# Altium schematic sheet Main.SchDoc
size A3
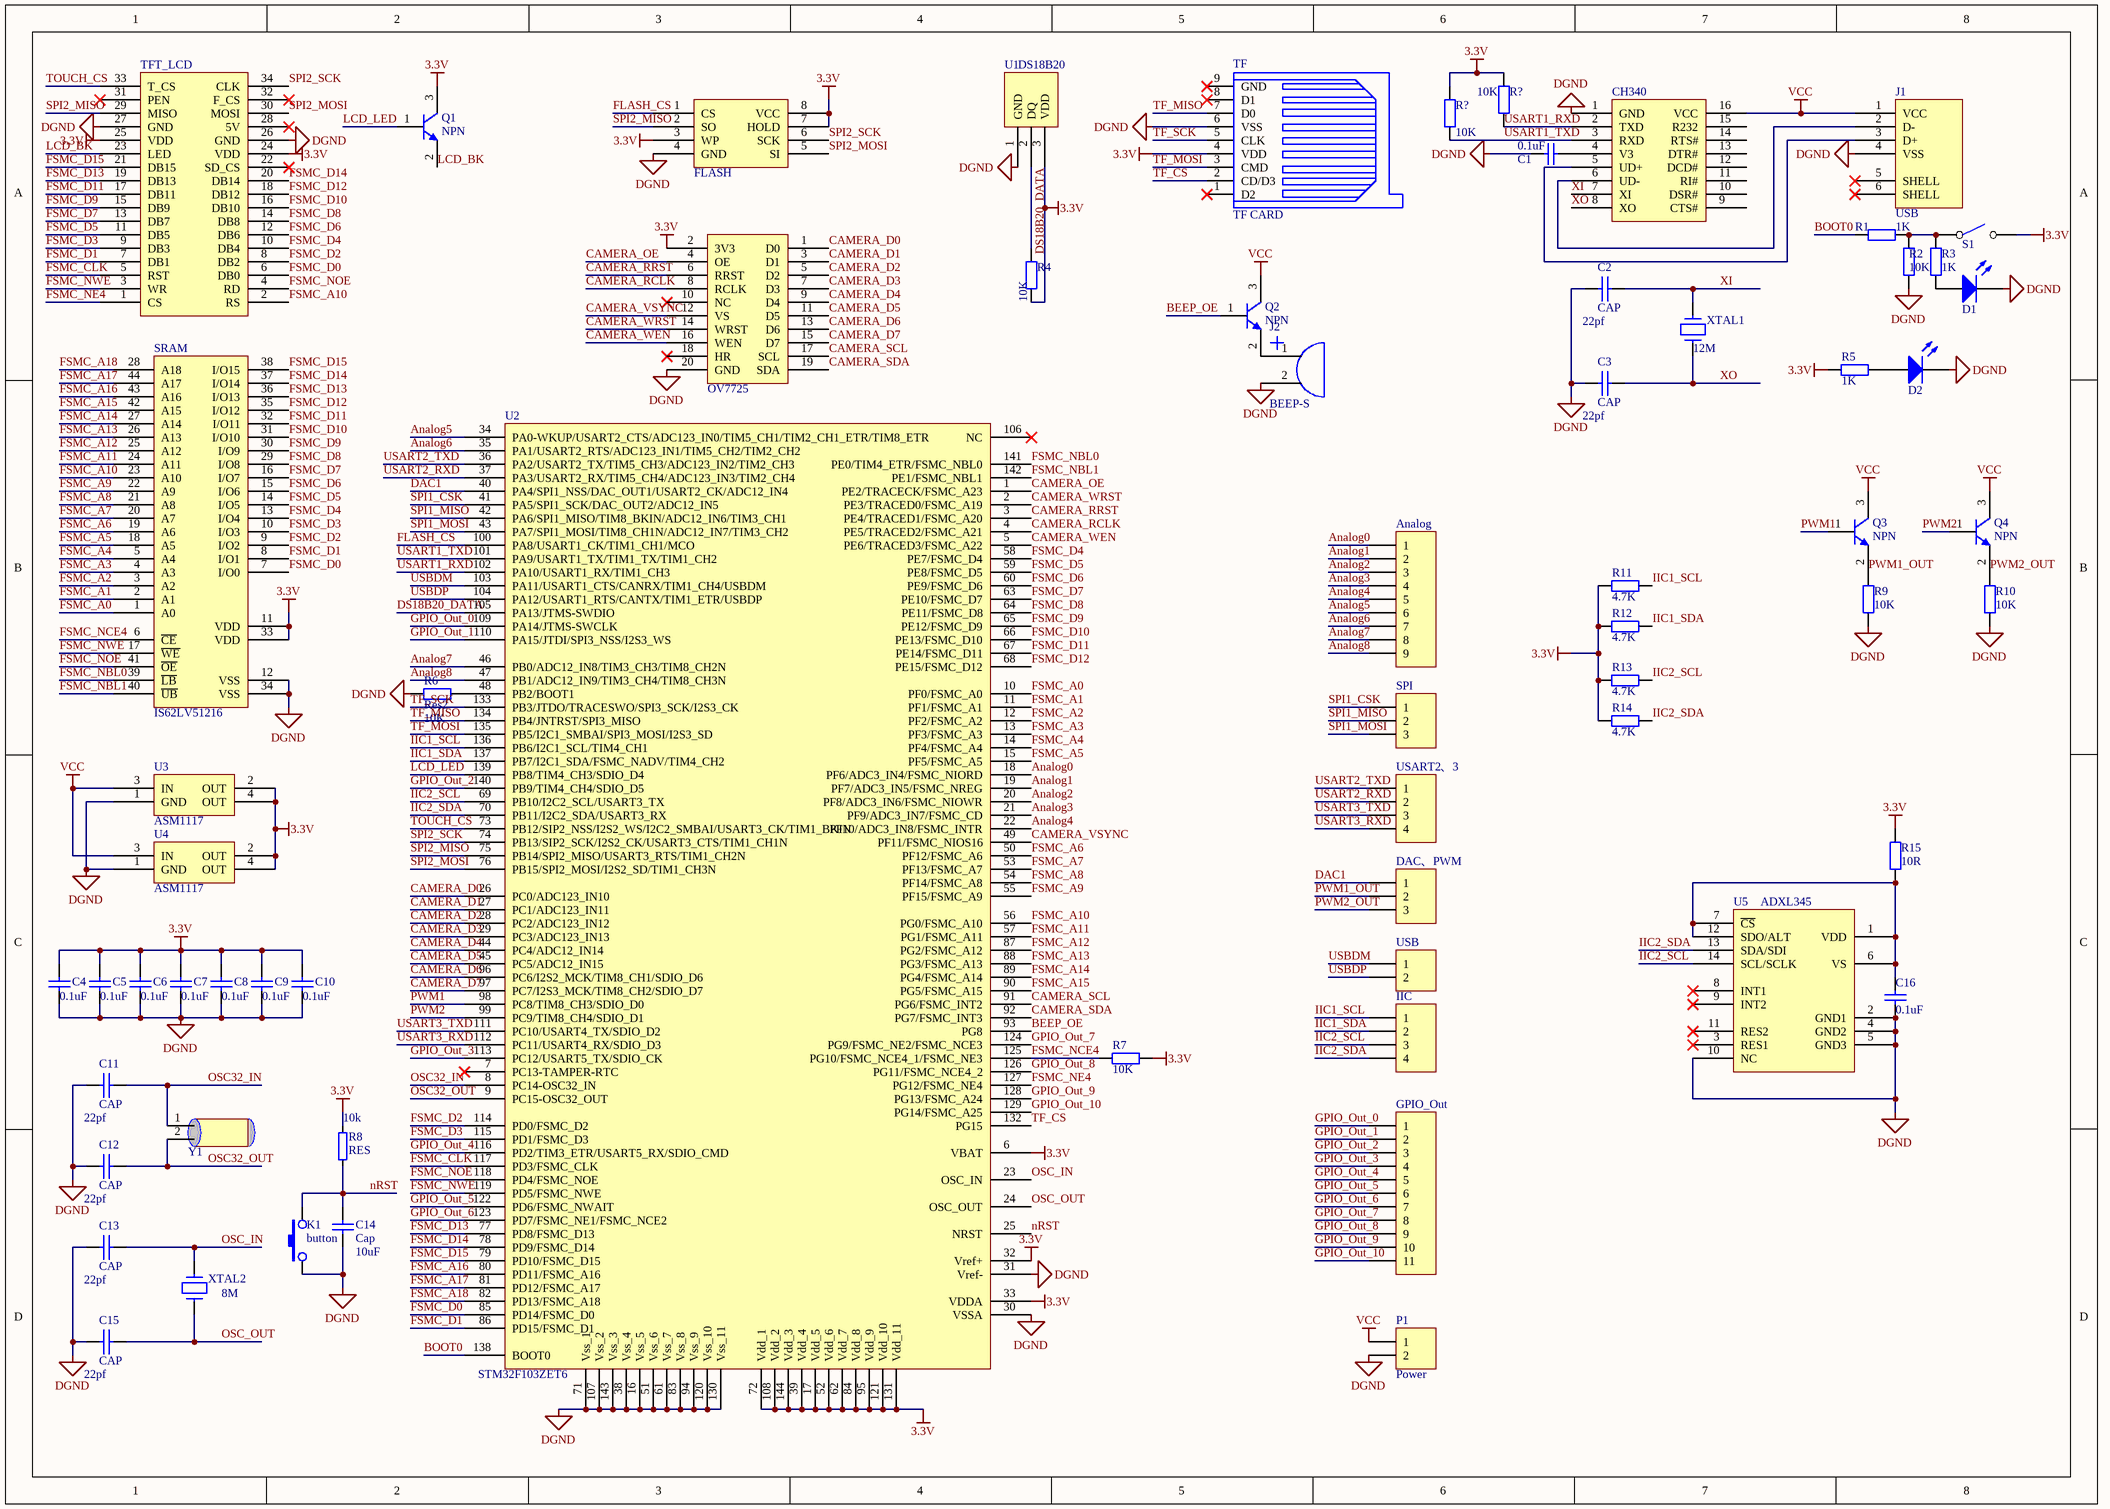
[diagram p0: Main.SchDoc]

## Parts
(Parts that share a designator on the sheet are numbered #1, #2 ... from top to bottom, then left to right.)
Analog  Header 9  [HDR1X9]  (value not drawn)
C1  value 0.1uF  [0805]  (hidden comment: Cap)
C2  CAP  value 22pf  [0805]
C3  CAP  value 22pf  [0805]
C4  value 0.1uF  [0805]  (hidden comment: Cap)
C5  value 0.1uF  [0805]  (hidden comment: Cap)
C6  value 0.1uF  [0805]  (hidden comment: Cap)
C7  value 0.1uF  [0805]  (hidden comment: Cap)
C8  value 0.1uF  [0805]  (hidden comment: Cap)
C9  value 0.1uF  [0805]  (hidden comment: Cap)
C10  value 0.1uF  [0805]  (hidden comment: Cap)
C11  CAP  value 22pf  [0805]
C12  CAP  value 22pf  [0805]
C13  CAP  value 22pf  [0805]
C14  Cap  value 10uF  [1206]
C15  CAP  value 22pf  [0805]
C16  value 0.1uF  [0805]  (hidden comment: Cap)
CH340  Component_1  [SOIC127P600X170-16N]  (value not drawn)
D1  LED0  [LED-0805]  (value not drawn)
D2  LED0  [LED-0805]  (value not drawn)
DAC、PWM  Header 3  [HDR1X3]  (value not drawn)
FLASH  W25Q64  [8S2_L]  (value not drawn)
GPIO_Out  Header 11  [HDR1X11]  (value not drawn)
IIC  Header 4  [HDR1X4]  (value not drawn)
J1  USB  [USB_A1]
J2  BEEP-S  [BEEP-S]
K1  button  [SW_PB4_A1]
OV7725  OV7725摄像头  [HDR2X10]  (value not drawn)
P1  Power  [HDR1X2]
Q1  NPN  [SOT23-3]
Q2  NPN  [SOT23-3]
Q3  NPN  [SOT23-3]
Q4  NPN  [SOT23-3]
R1  value 1K  [0805]  (hidden comment: Res2)
R2  value 10K  [0805]  (hidden comment: Res2)
R3  value 1K  [0805]  (hidden comment: Res2)
R4  value 10K  [0805]  (hidden comment: Res2)
R5  value 1K  [0805]  (hidden comment: Res2)
R6  Res2  value 10K  [0805]
R7  value 10K  [0805]  (hidden comment: Res2)
R8  RES  value 10k  [0805]
R9  value 10K  [0805]  (hidden comment: Res2)
R10  value 10K  [0805]  (hidden comment: Res2)
R11  value 4.7K  [0805]  (hidden comment: Res2)
R12  value 4.7K  [0805]  (hidden comment: Res2)
R13  value 4.7K  [0805]  (hidden comment: Res2)
R14  value 4.7K  [0805]  (hidden comment: Res2)
R15  value 10R  [0805]  (hidden comment: Res2)
R?#1  value 10K  [AXIAL-0.4]  (hidden comment: Res2)
R?#2  value 10K  [AXIAL-0.4]  (hidden comment: Res2)
S1  单刀开关  [SWITCH_B1]  (value not drawn)
SPI  Header 3  [HDR1X3]  (value not drawn)
SRAM  IS62LV51216  [TSOP-44]
TF  TF CARD  [TFP09-2-12B]
TFT_LCD  Component_1  [HDR2X17]  (value not drawn)
U1  DS18B20  [TO-92A]
U2  STM32F103ZET6  [TQFP-144]
U3  ASM1117  [SOT223]
U4  ASM1117  [SOT223]
U5  ADXL345  [PCBComponent_1]
USART2、3  Header 4  [HDR1X4]  (value not drawn)
USB  Header 2  [HDR1X2]  (value not drawn)
XTAL1  value 12M  [X-SM49]  (hidden comment: CRYSTAL)
XTAL2  value 8M  [X-SM49]  (hidden comment: CRYSTAL)
Y1  32K晶振  [X-TC15]  (value not drawn)

## Nets
3.3V: C4.2 C5.2 C6.2 C7.2 C8.2 C9.2 C10.2 FLASH.3(WP) FLASH.7(HOLD) FLASH.8(VCC) OV7725.2(3V3) Q1.3(C) R4.1 R5.1 R7.2 R8.2 R11.1 R12.1 R13.1 R14.1 R15.2 R?#1.2 R?#2.2 S1.2 SRAM.11(VDD) SRAM.33(VDD) TF.4(VDD) TFT_LCD.24(VDD) TFT_LCD.25(VDD) U1.3(VDD) U2.6(VBAT) U2.17(Vdd_5) U2.32(Vref+) U2.33(VDDA) U2.39(Vdd_4) U2.52(Vdd_6) U2.62(Vdd_7) U2.72(Vdd_1) U2.84(Vdd_8) U2.95(Vdd_9) U2.108(Vdd_2) U2.121(Vdd_10) U2.131(Vdd_11) U2.144(Vdd_3) U3.2(OUT) U3.4(OUT) U4.2(OUT) U4.4(OUT)
DGND: C1.2 C2.1 C3.1 C4.1 C5.1 C6.1 C7.1 C8.1 C9.1 C10.1 C11.1 C12.1 C13.1 C14.1 C15.1 C16.1 CH340.1(GND) D1.2(K) D2.2(K) FLASH.4(GND) J1.4(VSS) J2.2 K1.1 OV7725.20(GND) P1.2 R2.1 R6.1 R9.1 R10.1 SRAM.12(VSS) SRAM.34(VSS) TF.6(VSS) TFT_LCD.26(GND) TFT_LCD.27(GND) U1.1(GND) U2.16(Vss_5) U2.30(VSSA) U2.31(Vref-) U2.38(Vss_4) U2.51(Vss_6) U2.61(Vss_7) U2.71(Vss_1) U2.83(Vss_8) U2.94(Vss_9) U2.107(Vss_2) U2.120(Vss_10) U2.130(Vss_11) U2.143(Vss_3) U3.1(GND) U4.1(GND) U5.2(GND1) U5.4(GND2) U5.5(GND3) U5.10(NC)
VCC: CH340.16(VCC) J1.1(VCC) P1.1 Q2.3(C) Q3.3(C) Q4.3(C) U3.3(IN) U4.3(IN)
Analog0: Analog.1 U2.18(PF6/ADC3_IN4/FSMC_NIORD)
Analog1: Analog.2 U2.19(PF7/ADC3_IN5/FSMC_NREG)
Analog2: Analog.3 U2.20(PF8/ADC3_IN6/FSMC_NIOWR)
Analog3: Analog.4 U2.21(PF9/ADC3_IN7/FSMC_CD)
Analog4: Analog.5 U2.22(PF10/ADC3_IN8/FSMC_INTR)
Analog5: Analog.6 U2.34(PA0-WKUP/USART2_CTS/ADC123_IN0/TIM5_CH1/TIM2_CH1_ETR/TIM8_ETR)
Analog6: Analog.7 U2.35(PA1/USART2_RTS/ADC123_IN1/TIM5_CH2/TIM2_CH2)
Analog7: Analog.8 U2.46(PB0/ADC12_IN8/TIM3_CH3/TIM8_CH2N)
Analog8: Analog.9 U2.47(PB1/ADC12_IN9/TIM3_CH4/TIM8_CH3N)
BEEP_OE: Q2.1(B) U2.93(PG8)
BOOT0: R1.2 U2.138(BOOT0)
CAMERA_D0: OV7725.1(D0) U2.26(PC0/ADC123_IN10)
CAMERA_D1: OV7725.3(D1) U2.27(PC1/ADC123_IN11)
CAMERA_D2: OV7725.5(D2) U2.28(PC2/ADC123_IN12)
CAMERA_D3: OV7725.7(D3) U2.29(PC3/ADC123_IN13)
CAMERA_D4: OV7725.9(D4) U2.44(PC4/ADC12_IN14)
CAMERA_D5: OV7725.11(D5) U2.45(PC5/ADC12_IN15)
CAMERA_D6: OV7725.13(D6) U2.96(PC6/I2S2_MCK/TIM8_CH1/SDIO_D6)
CAMERA_D7: OV7725.15(D7) U2.97(PC7/I2S3_MCK/TIM8_CH2/SDIO_D7)
CAMERA_OE: OV7725.4(OE) U2.1(PE2/TRACECK/FSMC_A23)
CAMERA_RCLK: OV7725.8(RCLK) U2.4(PE5/TRACED2/FSMC_A21)
CAMERA_RRST: OV7725.6(RRST) U2.3(PE4/TRACED1/FSMC_A20)
CAMERA_SCL: OV7725.17(SCL) U2.91(PG6/FSMC_INT2)
CAMERA_SDA: OV7725.19(SDA) U2.92(PG7/FSMC_INT3)
CAMERA_VSYNC: OV7725.12(VS) U2.49(PF11/FSMC_NIOS16)
CAMERA_WEN: OV7725.16(WEN) U2.5(PE6/TRACED3/FSMC_A22)
CAMERA_WRST: OV7725.14(WRST) U2.2(PE3/TRACED0/FSMC_A19)
DAC1: DAC、PWM.1 U2.40(PA4/SPI1_NSS/DAC_OUT1/USART2_CK/ADC12_IN4)
DS18B20_DATA: R4.2 U1.2(DQ) U2.105(PA13/JTMS-SWDIO)
FLASH_CS: FLASH.1(CS) U2.100(PA8/USART1_CK/TIM1_CH1/MCO)
FSMC_A0: SRAM.1(A0) U2.10(PF0/FSMC_A0)
FSMC_A1: SRAM.2(A1) U2.11(PF1/FSMC_A1)
FSMC_A2: SRAM.3(A2) U2.12(PF2/FSMC_A2)
FSMC_A3: SRAM.4(A3) U2.13(PF3/FSMC_A3)
FSMC_A4: SRAM.5(A4) U2.14(PF4/FSMC_A4)
FSMC_A5: SRAM.18(A5) U2.15(PF5/FSMC_A5)
FSMC_A6: SRAM.19(A6) U2.50(PF12/FSMC_A6)
FSMC_A7: SRAM.20(A7) U2.53(PF13/FSMC_A7)
FSMC_A8: SRAM.21(A8) U2.54(PF14/FSMC_A8)
FSMC_A9: SRAM.22(A9) U2.55(PF15/FSMC_A9)
FSMC_A10: SRAM.23(A10) TFT_LCD.2(RS) U2.56(PG0/FSMC_A10)
FSMC_A11: SRAM.24(A11) U2.57(PG1/FSMC_A11)
FSMC_A12: SRAM.25(A12) U2.87(PG2/FSMC_A12)
FSMC_A13: SRAM.26(A13) U2.88(PG3/FSMC_A13)
FSMC_A14: SRAM.27(A14) U2.89(PG4/FSMC_A14)
FSMC_A15: SRAM.42(A15) U2.90(PG5/FSMC_A15)
FSMC_A16: SRAM.43(A16) U2.80(PD11/FSMC_A16)
FSMC_A17: SRAM.44(A17) U2.81(PD12/FSMC_A17)
FSMC_A18: SRAM.28(A18) U2.82(PD13/FSMC_A18)
FSMC_CLK: TFT_LCD.5(RST) U2.117(PD3/FSMC_CLK)
FSMC_D0: SRAM.7(I/O0) TFT_LCD.6(DB0) U2.85(PD14/FSMC_D0)
FSMC_D1: SRAM.8(I/O1) TFT_LCD.7(DB1) U2.86(PD15/FSMC_D1)
FSMC_D2: SRAM.9(I/O2) TFT_LCD.8(DB2) U2.114(PD0/FSMC_D2)
FSMC_D3: SRAM.10(I/O3) TFT_LCD.9(DB3) U2.115(PD1/FSMC_D3)
FSMC_D4: SRAM.13(I/O4) TFT_LCD.10(DB4) U2.58(PE7/FSMC_D4)
FSMC_D5: SRAM.14(I/O5) TFT_LCD.11(DB5) U2.59(PE8/FSMC_D5)
FSMC_D6: SRAM.15(I/O6) TFT_LCD.12(DB6) U2.60(PE9/FSMC_D6)
FSMC_D7: SRAM.16(I/O7) TFT_LCD.13(DB7) U2.63(PE10/FSMC_D7)
FSMC_D8: SRAM.29(I/O8) TFT_LCD.14(DB8) U2.64(PE11/FSMC_D8)
FSMC_D9: SRAM.30(I/O9) TFT_LCD.15(DB9) U2.65(PE12/FSMC_D9)
FSMC_D10: SRAM.31(I/O10) TFT_LCD.16(DB10) U2.66(PE13/FSMC_D10)
FSMC_D11: SRAM.32(I/O11) TFT_LCD.17(DB11) U2.67(PE14/FSMC_D11)
FSMC_D12: SRAM.35(I/O12) TFT_LCD.18(DB12) U2.68(PE15/FSMC_D12)
FSMC_D13: SRAM.36(I/O13) TFT_LCD.19(DB13) U2.77(PD8/FSMC_D13)
FSMC_D14: SRAM.37(I/O14) TFT_LCD.20(DB14) U2.78(PD9/FSMC_D14)
FSMC_D15: SRAM.38(I/O15) TFT_LCD.21(DB15) U2.79(PD10/FSMC_D15)
FSMC_NBL0: SRAM.39(~{LB}) U2.141(PE0/TIM4_ETR/FSMC_NBL0)
FSMC_NBL1: SRAM.40(~{UB}) U2.142(PE1/FSMC_NBL1)
FSMC_NCE4: R7.1 SRAM.6(~{CE}) U2.125(PG10/FSMC_NCE4_1/FSMC_NE3)
FSMC_NE4: TFT_LCD.1(CS) U2.127(PG12/FSMC_NE4)
FSMC_NOE: SRAM.41(~{OE}) TFT_LCD.4(RD) U2.118(PD4/FSMC_NOE)
FSMC_NWE: SRAM.17(~{WE}) TFT_LCD.3(WR) U2.119(PD5/FSMC_NWE)
GPIO_Out_0: GPIO_Out.1 U2.109(PA14/JTMS-SWCLK)
GPIO_Out_1: GPIO_Out.2 U2.110(PA15/JTDI/SPI3_NSS/I2S3_WS)
GPIO_Out_2: GPIO_Out.3 U2.140(PB9/TIM4_CH4/SDIO_D5)
GPIO_Out_3: GPIO_Out.4 U2.113(PC12/USART5_TX/SDIO_CK)
GPIO_Out_4: GPIO_Out.5 U2.116(PD2/TIM3_ETR/USART5_RX/SDIO_CMD)
GPIO_Out_5: GPIO_Out.6 U2.122(PD6/FSMC_NWAIT)
GPIO_Out_6: GPIO_Out.7 U2.123(PD7/FSMC_NE1/FSMC_NCE2)
GPIO_Out_7: GPIO_Out.8 U2.124(PG9/FSMC_NE2/FSMC_NCE3)
GPIO_Out_8: GPIO_Out.9 U2.126(PG11/FSMC_NCE4_2)
GPIO_Out_9: GPIO_Out.10 U2.128(PG13/FSMC_A24)
GPIO_Out_10: GPIO_Out.11 U2.129(PG14/FSMC_A25)
IIC1_SCL: IIC.1 R11.2 U2.136(PB6/I2C1_SCL/TIM4_CH1)
IIC1_SDA: IIC.2 R12.2 U2.137(PB7/I2C1_SDA/FSMC_NADV/TIM4_CH2)
IIC2_SCL: IIC.3 R13.2 U2.69(PB10/I2C2_SCL/USART3_TX) U5.14(SCL/SCLK)
IIC2_SDA: IIC.4 R14.2 U2.70(PB11/I2C2_SDA/USART3_RX) U5.13(SDA/SDI)
LCD_BK: Q1.2(E) TFT_LCD.23(LED)
LCD_LED: Q1.1(B) U2.139(PB8/TIM4_CH3/SDIO_D4)
nRST: C14.2 K1.2 R8.1 U2.25(NRST)
OSC32_IN: C11.2 U2.8(PC14-OSC32_IN) Y1.1(X1)
OSC32_OUT: C12.2 U2.9(PC15-OSC32_OUT) Y1.2(X2)
OSC_IN: C13.2 U2.23(OSC_IN) XTAL2.2
OSC_OUT: C15.2 U2.24(OSC_OUT) XTAL2.1
PWM1: Q3.1(B) U2.98(PC8/TIM8_CH3/SDIO_D0)
PWM1_OUT: DAC、PWM.2 Q3.2(E) R9.2
PWM2: Q4.1(B) U2.99(PC9/TIM8_CH4/SDIO_D1)
PWM2_OUT: DAC、PWM.3 Q4.2(E) R10.2
SPI1_CSK: SPI.1 U2.41(PA5/SPI1_SCK/DAC_OUT2/ADC12_IN5)
SPI1_MISO: SPI.2 U2.42(PA6/SPI1_MISO/TIM8_BKIN/ADC12_IN6/TIM3_CH1)
SPI1_MOSI: SPI.3 U2.43(PA7/SPI1_MOSI/TIM8_CH1N/ADC12_IN7/TIM3_CH2)
SPI2_MISO: FLASH.2(SO) TFT_LCD.29(MISO) U2.75(PB14/SPI2_MISO/USART3_RTS/TIM1_CH2N)
SPI2_MOSI: FLASH.5(SI) TFT_LCD.30(MOSI) U2.76(PB15/SPI2_MOSI/I2S2_SD/TIM1_CH3N)
SPI2_SCK: FLASH.6(SCK) TFT_LCD.34(CLK) U2.74(PB13/SIP2_SCK/I2S2_CK/USART3_CTS/TIM1_CH1N)
TF_CS: TF.2(CD/D3) U2.132(PG15)
TF_MISO: TF.7(D0) U2.134(PB4/JNTRST/SPI3_MISO)
TF_MOSI: TF.3(CMD) U2.135(PB5/I2C1_SMBAI/SPI3_MOSI/I2S3_SD)
TF_SCK: TF.5(CLK) U2.133(PB3/JTDO/TRACESWO/SPI3_SCK/I2S3_CK)
TOUCH_CS: TFT_LCD.33(T_CS) U2.73(PB12/SIP2_NSS/I2S2_WS/I2C2_SMBAI/USART3_CK/TIM1_BKIN)
USART1_RXD: CH340.2(TXD) R?#1.1 U2.102(PA10/USART1_RX/TIM1_CH3)
USART1_TXD: CH340.3(RXD) R?#2.1 U2.101(PA9/USART1_TX/TIM1_TX/TIM1_CH2)
USART2_RXD: U2.37(PA3/USART2_RX/TIM5_CH4/ADC123_IN3/TIM2_CH4) USART2、3.2
USART2_TXD: U2.36(PA2/USART2_TX/TIM5_CH3/ADC123_IN2/TIM2_CH3) USART2、3.1
USART3_RXD: U2.112(PC11/USART4_RX/SDIO_D3) USART2、3.4
USART3_TXD: U2.111(PC10/USART4_TX/SDIO_D2) USART2、3.3
USBDM: U2.103(PA11/USART1_CTS/CANRX/TIM1_CH4/USBDM) USB.1
USBDP: U2.104(PA12/USART1_RTS/CANTX/TIM1_ETR/USBDP) USB.2
XI: C2.2 CH340.7(XI) XTAL1.2
XO: C3.2 CH340.8(XO) XTAL1.1
NetC1_1: C1.1 CH340.4(V3)
NetC16_2: C16.2 R15.1 U5.1(VDD) U5.6(VS) U5.7(~{CS}) U5.12(SDO/ALT)
NetCH340_5: CH340.5(UD+) J1.3(D+)
NetCH340_6: CH340.6(UD-) J1.2(D-)
NetD1_1: D1.1(A) R3.1
NetD2_1: D2.1(A) R5.2
NetJ2_1: J2.1 Q2.2(E)
NetR1_1: R1.1 R2.2 R3.2 S1.1
NetR6_2: R6.2 U2.48(PB2/BOOT1)

Not connected (* = marked no-connect by the designer): CH340 9(CTS#) 10(DSR#) 11(RI#) 12(DCD#) 13(DTR#) 14(RTS#) 15(R232); J1 5(SHELL)* 6(SHELL)*; OV7725 10(NC)* 18(HR)*; TF 1(D2)* 8(D1)* 9(GND)*; TFT_LCD 22(SD_CS)* 28(5V)* 31(PEN)* 32(F_CS)*; U2 7(PC13-TAMPER-RTC)* 106(NC)*; U5 3(RES1)* 8(INT1)* 9(INT2)* 11(RES2)*

## Library data of the parts
Analog = Header 9: Header, 9-Pin; LatestRevisionDate: 17-Jul-2002; LatestRevisionNote: Re-released for DXP Platform.; Publisher: Altium Limited
C1 C4-C10 C14 C16 = Cap: Capacitor; Published: 8-Jun-2000; LatestRevisionDate: 17-Jul-2002; LatestRevisionNote: Re-released for DXP Platform.; PackageReference: RAD-0.3; Publisher: Altium Limited
  C1 C4-C10 C16: PackageDescription: Radial Cap, Thru-Hole; 2 Leads; 0.3 in Pin Spacing
D1 D2 = LED0: 发光二极管; Published: 8-Jun-2000; LatestRevisionDate: 08-Jul-2005; LatestRevisionNote: Mech Layer 1 removed.; PackageReference: LED-0; Publisher: Altium Limited
DAC、PWM SPI = Header 3: Header, 3-Pin; LatestRevisionDate: 17-Jul-2002; LatestRevisionNote: Re-released for DXP Platform.; Publisher: Altium Limited
GPIO_Out = Header 11: Header, 11-Pin; LatestRevisionDate: 17-Jul-2002; LatestRevisionNote: Re-released for DXP Platform.; Publisher: Altium Limited
IIC USART2、3 = Header 4: Header, 4-Pin; LatestRevisionDate: 17-Jul-2002; LatestRevisionNote: Re-released for DXP Platform.; Publisher: Altium Limited
J1 = USB: USB接口
J2 = BEEP-S: 有源蜂鸣器
P1 USB = Header 2: Header, 2-Pin; LatestRevisionDate: 17-Jul-2002; LatestRevisionNote: Re-released for DXP Platform.; Publisher: Altium Limited
Q1-Q4 = NPN1: 贴片三极管; Published: 8-Jun-2000; LatestRevisionDate: 15-Jan-2003; LatestRevisionNote: PCB Footprint 'BCY-W3/D4.7' replaced; DatasheetDocument: 1997; PackageDocument: Sep-1998; PackageReference: TO-92A; Publisher: Altium Limited; Code_JEDEC: TO-92A; ComponentLink1Description: Manufacturer Link; ComponentLink1URL: http://www.fairchildsemi.com/; ComponentLink2Description: Datasheet; ComponentLink2URL: http://www.fairchildsemi.com/ds/2N%2F2N3904.pdf
R1-R7 R9-R15 R?#1 R?#2 = Res2: Resistor; Published: 8-Jun-2000; LatestRevisionDate: 17-Jul-2002; LatestRevisionNote: Re-released for DXP Platform.; PackageReference: AXIAL-0.4; Publisher: Altium Limited; PackageDescription: Axial Device, Thru-Hole; 2 Leads; 0.4 in Pin Spacing
SRAM = IS61LV51216: 静态RAM
U1 = DS18B20: 温度传感器
U3 U4 = ASM1117: 3.3V稳压芯片